# Altium schematic sheet WiFiCar.SchDoc: WiFiCar V1.0
size A4 portrait; Author: Álvaro Henrique; Revision: 1; SheetNumber: 1; SheetTotal: 1; PageSetup: Record=PageOptions|CenterHorizontal=True|CenterVertical=True|PrintScale=1.00|XCorrection=1.00|YCorrection=1.00|PrintKind=1|BorderSize=5000000|LeftOffset=0|BottomOffset=0|Orientation=1|PaperLength=1000|PaperWidth=1000|Scale=100|PaperSource=7|PrintQuality=-3|MediaType=1|DitherType=10|PrintScaleMode=1|PaperKind=A4|PaperIndex=9; ProjectName: WiFiCar
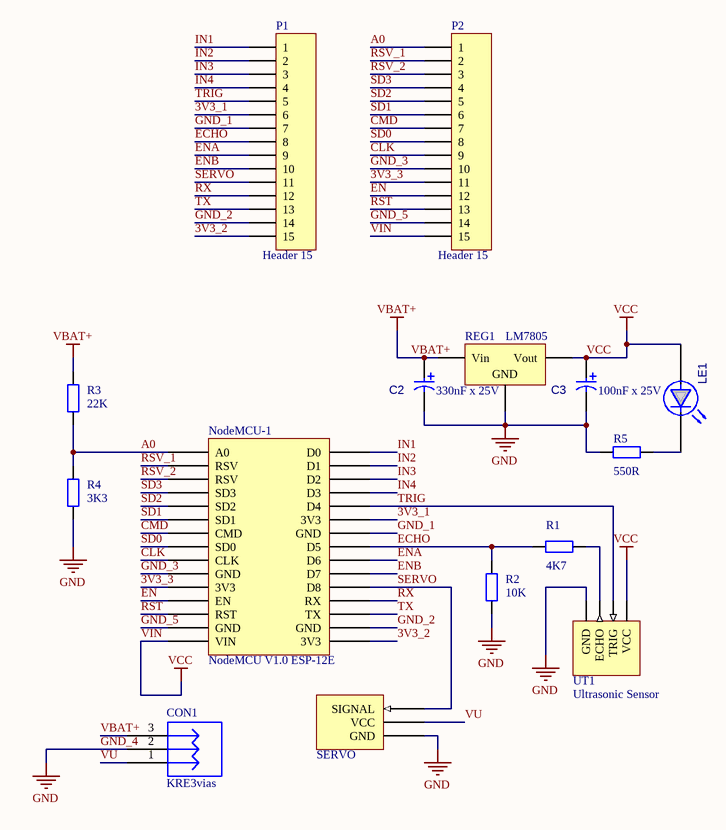
[diagram p0: WiFiCar.SchDoc]

## Parts
C2  Valor: 330nF x 25V  [CAPACITOR ELETROLITICO 4x5x1.6mm]  (hidden comment: Capacitor Eletrolitico)
C3  Valor: 100nF x 25V  [CAPACITOR ELETROLITICO 4x5x1.6mm]  (hidden comment: Capacitor Eletrolitico)
CON1  KRE3vias  [KRE3-3vias]
LE1  LED PTH  [LED PTH 3mm VERDE]  (value not drawn)
NodeMCU-1  NodeMCU V1.0 ESP-12E  [NodeMCU V1.0 ESP-12E]
P1  Header 15  [HDR1X15]
P2  Header 15  [HDR1X15]
R1  value 4K7  [AXIAL-0.4]  (hidden comment: Res2)
R2  value 10K  [AXIAL-0.4]  (hidden comment: Res2)
R3  value 22K  [AXIAL-0.4]  (hidden comment: Res2)
R4  value 3K3  [AXIAL-0.4]  (hidden comment: Res2)
R5  value 550R  [AXIAL-0.4]  (hidden comment: Res2)
REG1  LM7805  [TO-220]
SERVO  Micro 9g  (value not drawn)
UT1  Ultrasonic Sensor  [HC-SR04]

## Nets
GND_4: C2.2(MINUS) C3.2(MINUS) CON1.2 R2.1 R4.2 R5.1 REG1.2(GND) SERVO.GND UT1.GND  [also labelled GND]
VBAT+: C2.1(PLUS) CON1.3 R3.1 REG1.1(Vin)
VCC: C3.1(PLUS) LE1.1 NodeMCU-1.VIN P2.15 REG1.3(Vout) UT1.VCC  [also labelled VIN]
3V3_1: NodeMCU-1.3V3 P1.6
3V3_2: NodeMCU-1.3V3 P1.15
3V3_3: NodeMCU-1.3V3 P2.11
A0: NodeMCU-1.A0 P2.1 R3.2 R4.1
CLK: NodeMCU-1.CLK P2.9
CMD: NodeMCU-1.CMD P2.7
ECHO: NodeMCU-1.D5 P1.8 R1.1 R2.2
EN: NodeMCU-1.EN P2.12
ENA: NodeMCU-1.D6 P1.9
ENB: NodeMCU-1.D7 P1.10
GND_1: NodeMCU-1.GND P1.7
GND_2: NodeMCU-1.GND P1.14
GND_3: NodeMCU-1.GND P2.10
GND_5: NodeMCU-1.GND P2.14
IN1: NodeMCU-1.D0 P1.1
IN2: NodeMCU-1.D1 P1.2
IN3: NodeMCU-1.D2 P1.3
IN4: NodeMCU-1.D3 P1.4
RST: NodeMCU-1.RST P2.13
RSV_1: NodeMCU-1.RSV P2.2
RSV_2: NodeMCU-1.RSV P2.3
RX: NodeMCU-1.RX P1.12
SD0: NodeMCU-1.SD0 P2.8
SD1: NodeMCU-1.SD1 P2.6
SD2: NodeMCU-1.SD2 P2.5
SD3: NodeMCU-1.SD3 P2.4
SERVO: NodeMCU-1.D8 P1.11 SERVO.SIGNAL
TRIG: NodeMCU-1.D4 P1.5 UT1.TRIG
TX: NodeMCU-1.TX P1.13
VU: CON1.1 SERVO.VCC
NetLE1_2: LE1.2 R5.2
NetR1_2: R1.2 UT1.ECHO

## Notes on the sheet
- Title
- Size:
- Date:
- A4
- Author:
- Time:
- Sheet
- Revision:
- of
- File:

## Library data of the parts
C2 C3 = Capacitor Eletrolitico: Descrição: Capacitor Eletrolitico PTH; Encapsulamento: PTH Radia Xmm x Ymm; Marca: *; Modelo: *; Observação: *
CON1 = KRE3vias: Conector 3 vias; Descrição: Conector KRE 3 vias 180º; Encapsulamento: PTH - 180º; Modelo: 3 vias - 180º; Marca: *; Observação: *
LE1 = LED PTH: Encapsulamento: PTH 3mm; Observação: Led Verde; Descrição: Led PTH; Valor: *; Marca: *; Modelo: *
NodeMCU-1 = NodeMCU V1.0 ESP-12E: NodeMCU V1.0 ESP8266 (ESP-12E)
P1 P2 = Header 15: Header, 15-Pin; LatestRevisionDate: 17-Jul-2002; LatestRevisionNote: Re-released for DXP Platform.; Publisher: Altium Limited
R1-R5 = Res2: Resistor; Published: 8-Jun-2000; LatestRevisionDate: 17-Jul-2002; LatestRevisionNote: Re-released for DXP Platform.; PackageReference: AXIAL-0.4; Publisher: Altium Limited; PackageDescription: Axial Device, Thru-Hole; 2 Leads; 0.4 in Pin Spacing
REG1 = LM7805: Regulador de Tensão 5V; Descrição: Regulador de Tensão 3V3; Encapsulamento: PTH TO-220; Valor: *; Marca: *; Observação: *; Modelo: LM7805
SERVO = MICRO 9G SERVO
UT1 = HC-SR04